# Altium schematic sheet motors-overview.SchDoc
size A4; DrawnBy: Lorna Lan; Revision: v2; SheetNumber: 3; SheetTotal: 16
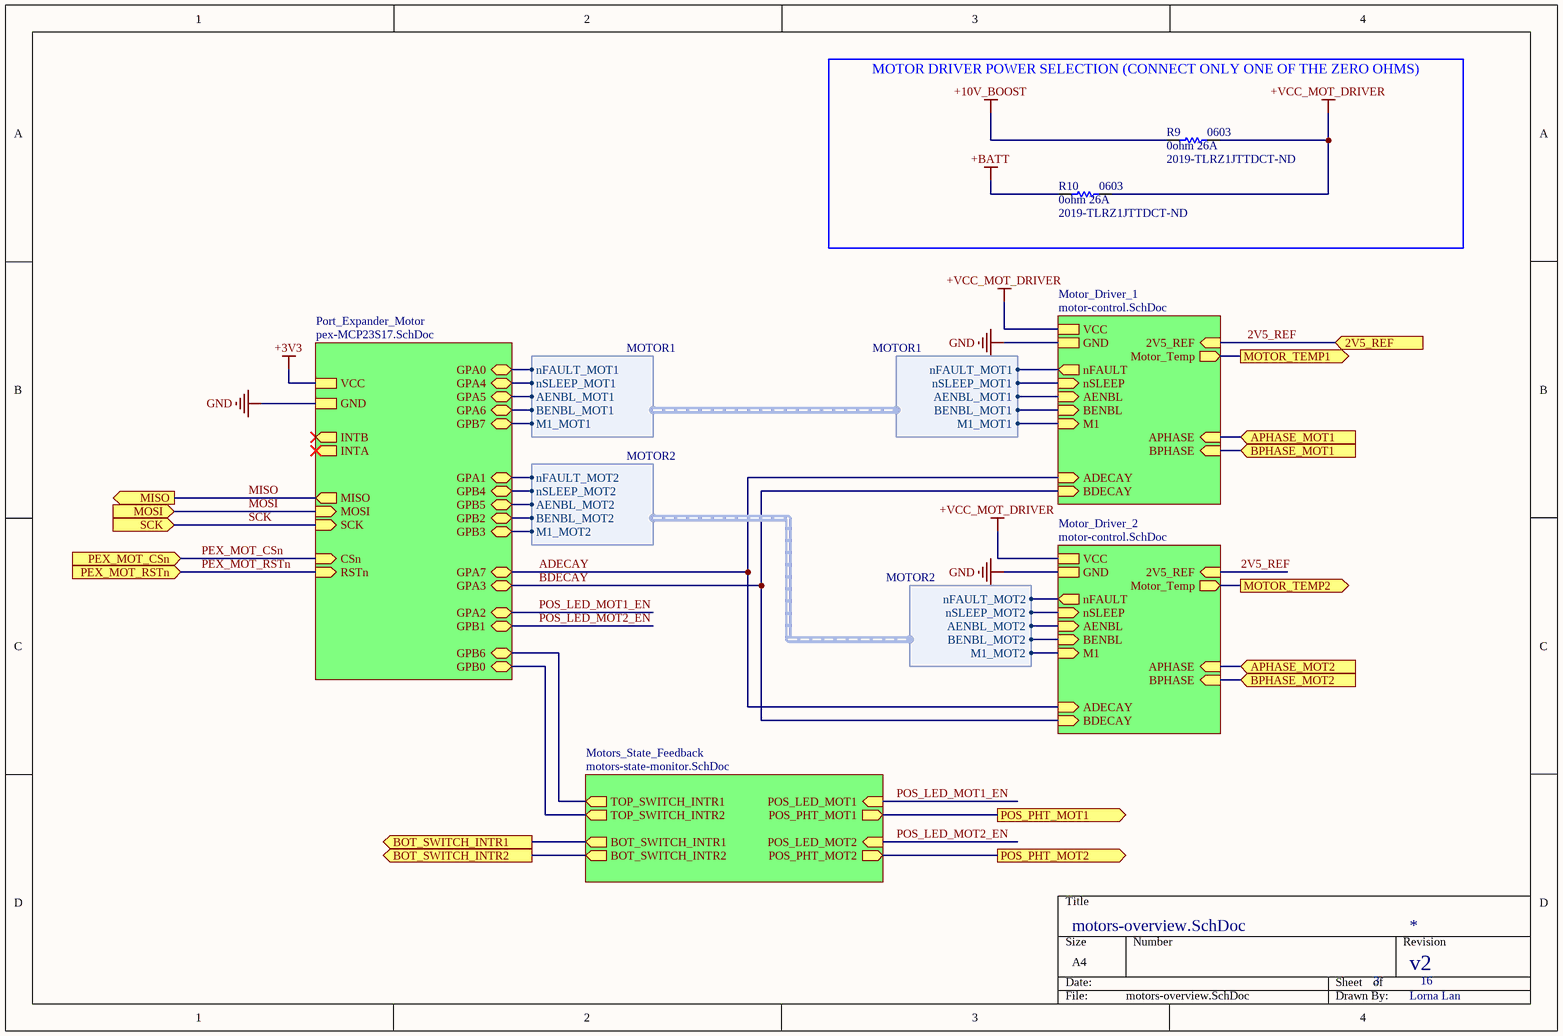
[diagram p0: motors-overview.SchDoc]

## Parts
R9  0603  value 0ohm 26A  Supplier Part Number 1: 2019-TLRZ1JTTDCT-ND  [RES0603R]
R10  0603  value 0ohm 26A  Supplier Part Number 1: 2019-TLRZ1JTTDCT-ND  [RES0603R]

## Sub-sheets
Motor_Driver_1 = motor-control.SchDoc: GND, nSLEEP (in), nFAULT (out), VCC, M1 (in), ADECAY (in), BDECAY (in), BPHASE (in), BENBL (in), APHASE (in), AENBL (in), 2V5_REF (in), Motor_Temp (out)
Motor_Driver_2 = motor-control.SchDoc: GND, nSLEEP (in), nFAULT (out), VCC, M1 (in), ADECAY (in), BDECAY (in), BPHASE (in), BENBL (in), APHASE (in), AENBL (in), 2V5_REF (in), Motor_Temp (out)
Motors_State_Feedback = motors-state-monitor.SchDoc: TOP_SWITCH_INTR1 (out), BOT_SWITCH_INTR1 (out), BOT_SWITCH_INTR2 (out), POS_LED_MOT2 (in), TOP_SWITCH_INTR2 (out), POS_PHT_MOT1 (out), POS_PHT_MOT2 (out), POS_LED_MOT1 (in)
Port_Expander_Motor = pex-MCP23S17.SchDoc: GPA0 (bidir), GPA6 (bidir), GPB1 (bidir), INTB (out), INTA (out), VCC, GND, MISO (out), MOSI (in), SCK (in), CSn (in), RSTn (in), GPA4 (bidir), GPA2 (bidir), GPA7 (bidir), GPB6 (bidir), GPA5 (bidir), GPB7 (bidir), GPA3 (bidir), GPA1 (bidir), GPB4 (bidir), GPB2 (bidir), GPB3 (bidir), GPB5 (bidir), GPB0 (bidir)

## Ports
2V5_REF (in), APHASE_MOT1 (in), APHASE_MOT2 (in), BOT_SWITCH_INTR1 (out), BOT_SWITCH_INTR2 (out), BPHASE_MOT1 (in), BPHASE_MOT2 (in), MISO (out), MOSI (in), MOTOR_TEMP1 (out), MOTOR_TEMP2 (out), PEX_MOT_CSn (in), PEX_MOT_RSTn (in), POS_PHT_MOT1 (out), POS_PHT_MOT2 (out), SCK (in)

## Harnesses
MOTOR1: nFAULT_MOT1, nSLEEP_MOT1, AENBL_MOT1, BENBL_MOT1, M1_MOT1
MOTOR2: nFAULT_MOT2, nSLEEP_MOT2, AENBL_MOT2, BENBL_MOT2, M1_MOT2

## Nets
+3V3: sheet Port_Expander_Motor/VCC
+10V_BOOST: R9.1
+BATT: R10.1
+VCC_MOT_DRIVER: R9.2 R10.2 ; sheet Motor_Driver_1/VCC, sheet Motor_Driver_2/VCC
GND: sheet Motor_Driver_1/GND, sheet Port_Expander_Motor/GND, sheet Motor_Driver_2/GND
2V5_REF: port 2V5_REF, sheet Motor_Driver_1/2V5_REF, sheet Motor_Driver_2/2V5_REF
ADECAY: sheet Motor_Driver_1/ADECAY, sheet Port_Expander_Motor/GPA7, sheet Motor_Driver_2/ADECAY
APHASE_MOT1: port APHASE_MOT1, sheet Motor_Driver_1/APHASE
APHASE_MOT2: port APHASE_MOT2, sheet Motor_Driver_2/APHASE
BDECAY: sheet Motor_Driver_1/BDECAY, sheet Port_Expander_Motor/GPA3, sheet Motor_Driver_2/BDECAY
BOT_SWITCH_INTR1: port BOT_SWITCH_INTR1, sheet Motors_State_Feedback/BOT_SWITCH_INTR1
BOT_SWITCH_INTR2: port BOT_SWITCH_INTR2, sheet Motors_State_Feedback/BOT_SWITCH_INTR2
BPHASE_MOT1: port BPHASE_MOT1, sheet Motor_Driver_1/BPHASE
BPHASE_MOT2: port BPHASE_MOT2, sheet Motor_Driver_2/BPHASE
MISO: port MISO, sheet Port_Expander_Motor/MISO
MOSI: port MOSI, sheet Port_Expander_Motor/MOSI
MOTOR_TEMP1: port MOTOR_TEMP1, sheet Motor_Driver_1/Motor_Temp
MOTOR_TEMP2: port MOTOR_TEMP2, sheet Motor_Driver_2/Motor_Temp
PEX_MOT_CSn: port PEX_MOT_CSn, sheet Port_Expander_Motor/CSn
PEX_MOT_RSTn: port PEX_MOT_RSTn, sheet Port_Expander_Motor/RSTn
POS_LED_MOT1_EN: sheet Port_Expander_Motor/GPA2, sheet Motors_State_Feedback/POS_LED_MOT1
POS_LED_MOT2_EN: sheet Port_Expander_Motor/GPB1, sheet Motors_State_Feedback/POS_LED_MOT2
POS_PHT_MOT1: port POS_PHT_MOT1, sheet Motors_State_Feedback/POS_PHT_MOT1
POS_PHT_MOT2: port POS_PHT_MOT2, sheet Motors_State_Feedback/POS_PHT_MOT2
SCK: port SCK, sheet Port_Expander_Motor/SCK
(unnamed): sheet Motor_Driver_1/nSLEEP, sheet Port_Expander_Motor/GPA4, harness MOTOR1.nSLEEP_MOT1
(unnamed): sheet Motor_Driver_1/nFAULT, sheet Port_Expander_Motor/GPA0, harness MOTOR1.nFAULT_MOT1
(unnamed): sheet Motor_Driver_1/M1, sheet Port_Expander_Motor/GPB7, harness MOTOR1.M1_MOT1
(unnamed): sheet Motor_Driver_1/BENBL, sheet Port_Expander_Motor/GPA6, harness MOTOR1.BENBL_MOT1
(unnamed): sheet Motor_Driver_1/AENBL, sheet Port_Expander_Motor/GPA5, harness MOTOR1.AENBL_MOT1
(unnamed): sheet Port_Expander_Motor/GPB6, sheet Motors_State_Feedback/TOP_SWITCH_INTR1
(unnamed): sheet Port_Expander_Motor/GPA1, sheet Motor_Driver_2/nFAULT, harness MOTOR2.nFAULT_MOT2
(unnamed): sheet Port_Expander_Motor/GPB4, sheet Motor_Driver_2/nSLEEP, harness MOTOR2.nSLEEP_MOT2
(unnamed): sheet Port_Expander_Motor/GPB2, sheet Motor_Driver_2/BENBL, harness MOTOR2.BENBL_MOT2
(unnamed): sheet Port_Expander_Motor/GPB3, sheet Motor_Driver_2/M1, harness MOTOR2.M1_MOT2
(unnamed): sheet Port_Expander_Motor/GPB5, sheet Motor_Driver_2/AENBL, harness MOTOR2.AENBL_MOT2
(unnamed): sheet Port_Expander_Motor/GPB0, sheet Motors_State_Feedback/TOP_SWITCH_INTR2

## Notes on the sheet
- MOTOR DRIVER POWER SELECTION (CONNECT ONLY ONE OF THE ZERO OHMS)

## Library data of the parts
R9 R10 = RES0603: 0603 resistor; Supplier 1: Digi-Key